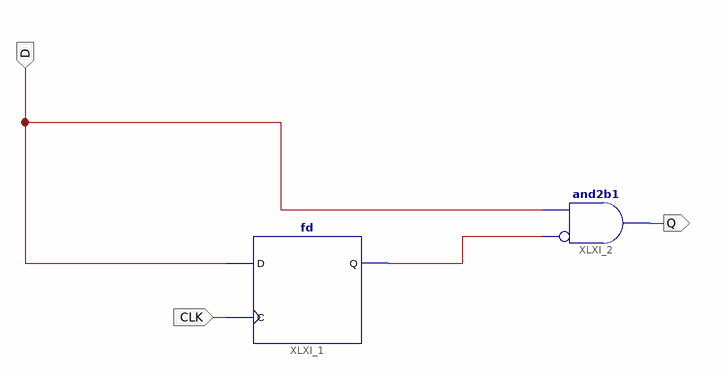
[diagram p0: schematic sheet 1]
// Xilinx ISE schematic Debounce.sch (spartan3e) as structural Verilog: 2 symbols, 3 ports
module Debounce (
  input  CLK,
  input  D,
  output Q
);

  wire XLXN_2;

  fd XLXI_1 (.C(CLK), .D(D), .Q(XLXN_2));
  and XLXI_2 (Q, ~XLXN_2, D);  // and2b1
endmodule
